# Altium schematic sheet Main.SchDoc
size 88 x 55 mm
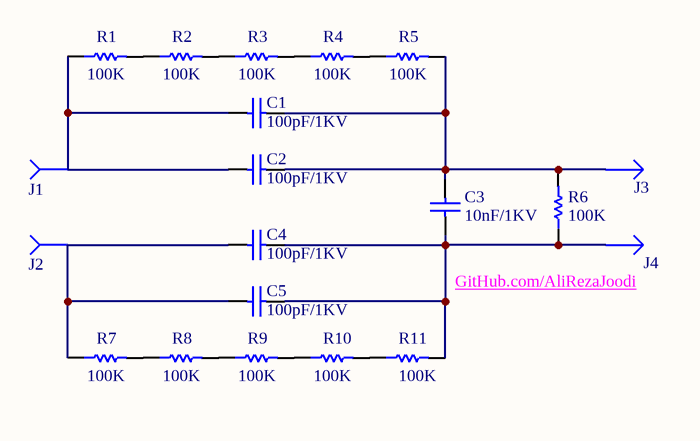
[diagram p0: Main.SchDoc]

## Parts
C1  100pF/1KV  [THD_P5.08/D4.2/T2]
C2  100pF/1KV  [THD_P5.08/D4.2/T2]
C3  10nF/1KV  [THD_P5.08/D4.2/T2]
C4  100pF/1KV  [THD_P5.08/D4.2/T2]
C5  100pF/1KV  [THD_P5.08/D4.2/T2]
J1  (no value)
J2  (no value)
J3  (no value)
J4  (no value)
R1  100K  [THD_AXIAL0.4]
R2  100K  [THD_AXIAL0.4]
R3  100K  [THD_AXIAL0.4]
R4  100K  [THD_AXIAL0.4]
R5  100K  [THD_AXIAL0.4]
R6  100K  [THD_AXIAL0.4]
R7  100K  [THD_AXIAL0.4]
R8  100K  [THD_AXIAL0.4]
R9  100K  [THD_AXIAL0.4]
R10  100K  [THD_AXIAL0.4]
R11  100K  [THD_AXIAL0.4]

## Nets
NetC1_1: C1.1 C2.1 C3.2 R5.1 R6.1
NetC1_2: C1.2 C2.2 R1.2
NetC3_1: C3.1 C4.1 C5.1 R6.2 R11.1
NetC4_2: C4.2 C5.2 R7.2
NetR1_1: R1.1 R2.2
NetR2_1: R2.1 R3.2
NetR3_1: R3.1 R4.2
NetR4_1: R4.1 R5.2
NetR7_1: R7.1 R8.2
NetR8_1: R8.1 R9.2
NetR9_1: R9.1 R10.2
NetR10_1: R10.1 R11.2

## Notes on the sheet
- GitHub.com/AliRezaJoodi

## Library data of the parts
C1-C5 = Capacitor_Ceramic: Capacitor, Ceramic Multilayer; Revision: July-2002: Re-released for DXP Platform.
J1 J2 = Connector_Socket_1Pin_Female_Lable: Lable Connector, Socket, 1Pin; Revision: July-2002: Re-released for DXP Platform.
J3 J4 = Connector_Socket_1Pin_Male_Lable: Lable Connector, Socket, 1Pin; Revision: July-2002: Re-released for DXP Platform.
R1-R11 = Resistor_2Form: Resistor, 1/4W, 5%; Revision: July-2002: Re-released for DXP Platform.